# EAGLE design sensors (EAGLE 7.5.0)
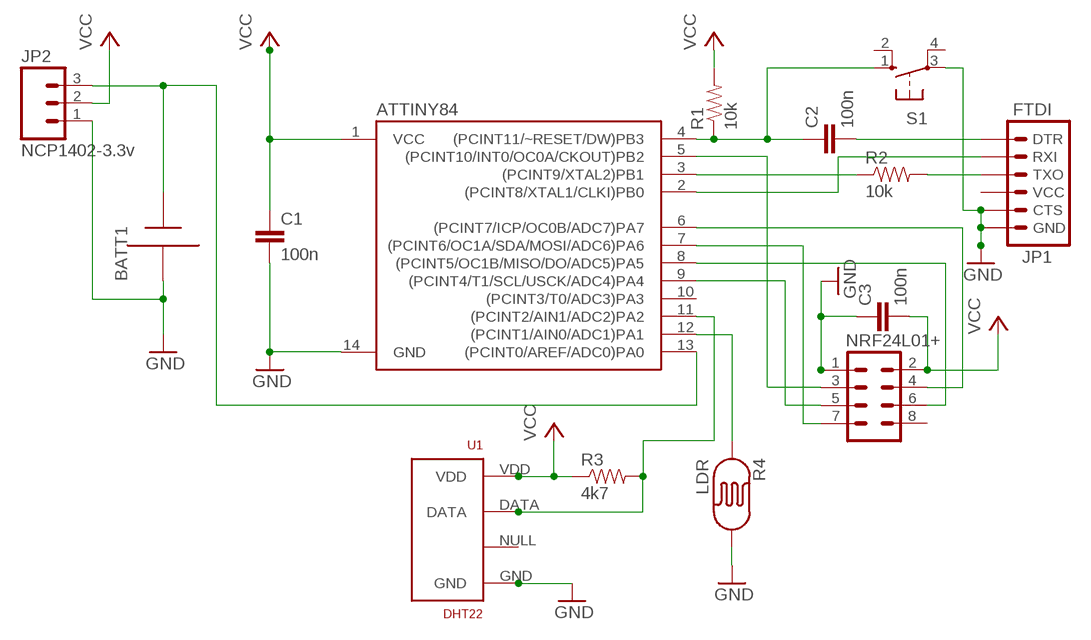
[diagram p0: schematic, sheet 1]

## Parts
ATTINY84  ATTINY84ATTINY84-20PU  [DIL14]
BATT1  AAA  [12BH412]
C1  100n  CAPPTH1  [CAP-PTH-5MM]
C2  100n  CAPPTH1  [CAP-PTH-5MM]
C3  100n  CAPPTH1  [CAP-PTH-5MM]
JP1  FTDI  ARDUINO_SERIAL_PROGRAMPTH  [1X06]
JP2  NCP1402-3.3v  M03PTH  [1X03]
NRF24L01+  M04X2  [2X4]
R1  10k  RESISTOREZ  [AXIAL-0.3EZ]
R2  10k  RESISTOREZ  [AXIAL-0.3EZ]
R3  4k7  RESISTOREZ  [AXIAL-0.3EZ]
R4  LDR  PHOTOCELLPTH  [PHOTOCELL]
S1  10-XX  [B3F-10XX]
U1  DHT22  RHT03_DHT-22_AM2302  [RHT03_DHT-22]

## Nets
GND: ATTINY84.14(GND) BATT1.- C1.2 C3.1 JP1.5(CTS) JP1.6(GND) JP2.1 NRF24L01+.1 R4.2 S1.3(P) U1.GND
N$1: ATTINY84.6((PCINT7/ICP/OC0B/ADC7)PA7) NRF24L01+.4
N$2: ATTINY84.3((PCINT9/XTAL2)PB1) R2.P$1
N$3: ATTINY84.4((PCINT11/~RESET/DW)PB3) C2.1 R1.P$1 S1.1(S)
N$4: C2.2 JP1.1(DTR)
N$5: JP1.3(TXO) R2.P$2
N$6: ATTINY84.2((PCINT8/XTAL1/CLKI)PB0) JP1.2(RXI)
N$7: ATTINY84.7((PCINT6/OC1A/SDA/MOSI/ADC6)PA6) NRF24L01+.7
N$8: ATTINY84.13((PCINT0/AREF/ADC0)PA0) BATT1.+ JP2.3
N$9: ATTINY84.9((PCINT4/T1/SCL/USCK/ADC4)PA4) NRF24L01+.5
N$10: ATTINY84.12((PCINT1/AIN0/ADC1)PA1) R4.1
N$11: ATTINY84.11((PCINT2/AIN1/ADC2)PA2) R3.P$2 U1.DATA
N$12: ATTINY84.8((PCINT5/OC1B/MISO/DO/ADC5)PA5) NRF24L01+.6
N$13: ATTINY84.5((PCINT10/INT0/OC0A/CKOUT)PB2) NRF24L01+.3
VCC: ATTINY84.1(VCC) C1.1 C3.2 JP2.2 NRF24L01+.2 R1.P$2 R3.P$1 U1.VDD
Unconnected: ATTINY84.10((PCINT3/T0/ADC3)PA3) JP1.4(VCC) NRF24L01+.8 S1.2(S1) S1.4(P1) U1.NULL

## Library data of the parts
ATTINY84 = SparkFun-DigitalIC:ATTINY84: Atmel 14-pin 2/4/8kB flash uC
BATT1 = adafruit:AAA: AAA PC pin holder Mouser part #12BH412 - but pretty much any 1x AAA battery holder should be the same http://www.ladyada.net/library/pcb/eaglelibrary.html
C1-C3 = SparkFun-Capacitors:CAP: Capacitor Standard 0603 ceramic capacitor, and 0.1" leaded capacitor.
JP1 = SparkFun-Connectors:ARDUINO_SERIAL_PROGRAM: FTDI connector footprints
JP2 = SparkFun-Connectors:M03: Header 3 Standard 3-pin 0.1" header. Use with straight break away headers (SKU : PRT-00116), right angle break away headers (PRT-00553), swiss pins (PRT-00743), machine pins (PRT-00117), and female headers (PRT-00115). Molex polarized connector foot print use with SKU : PRT-08232 with associated crimp pins and housings.
NRF24L01+ = SparkFun-Connectors:M04X2: .1" header, two rows of four.
R1-R3 = SparkFun-Resistors:RESISTOR: Resistor Basic schematic elements and footprints for 0603, 1206, and PTH resistors.
R4 = SparkFun-Sensors:PHOTOCELL: CdS photoresistor. This is a low cost way to detect light levels. Resistance decreases with more incoming light. SparkFun SKU: SEN-09088
S1 = switch-omron:10-XX: OMRON SWITCH; MPN: B3F-1000; OC_FARNELL: 176432; OC_NEWARK: 36M3542
U1 = RHT03_DHT-22_AM2302:RHT03_DHT-22_AM2302: RHT03 / DHT-22 / AM2302 Packages and symbol for the RHT03 / DHT-22 relative humidity and temperature sensor. Note: The AM2302 is a wired version of the DHT-22 which typically requires less clearance and is thus provided as a separate package.; PROD_ID: SEN-10167

## Net classes
0 default: clearance 0.205 mm

## Board
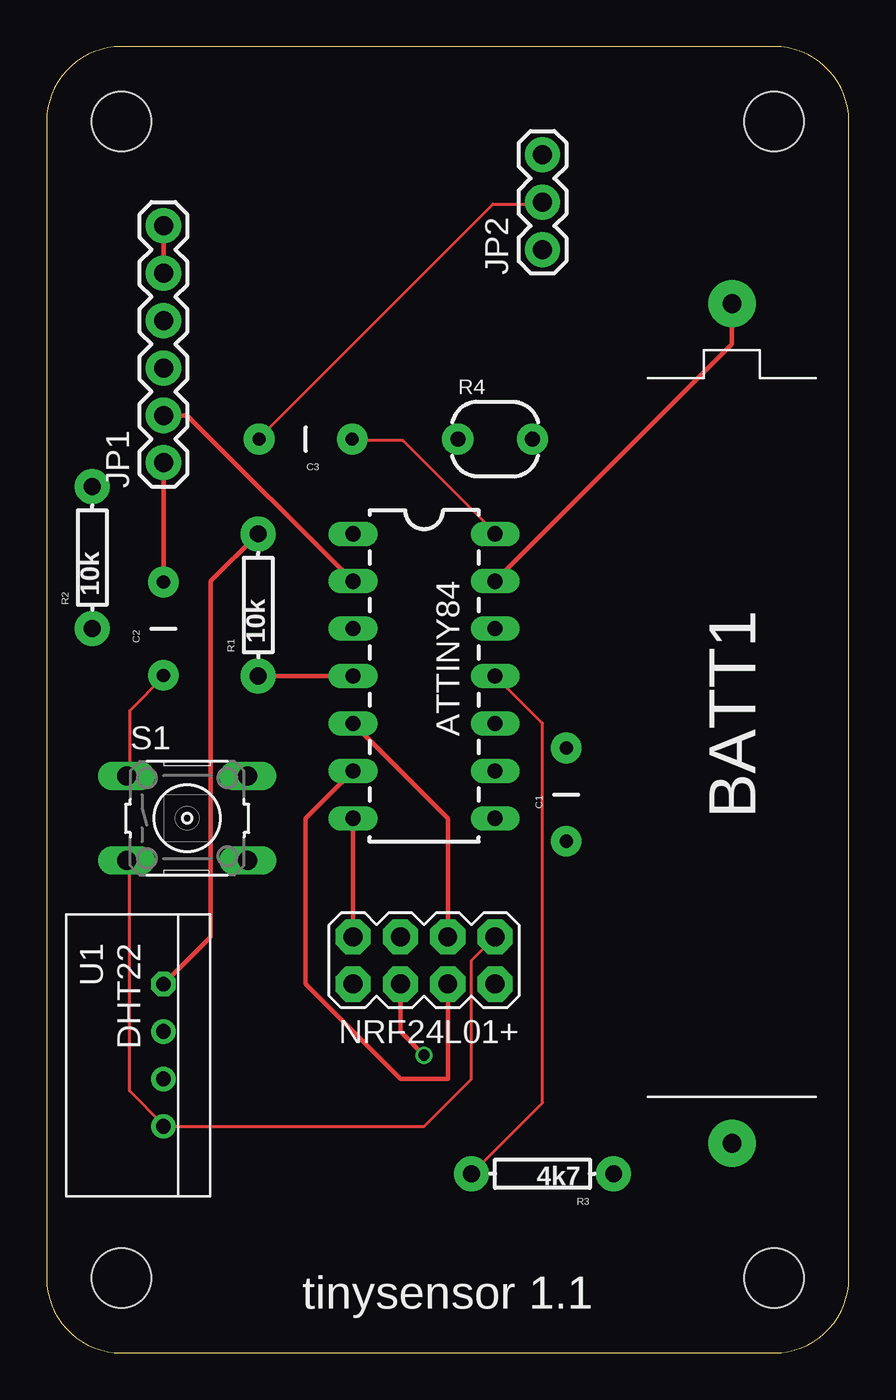
[diagram p1: board, top side]
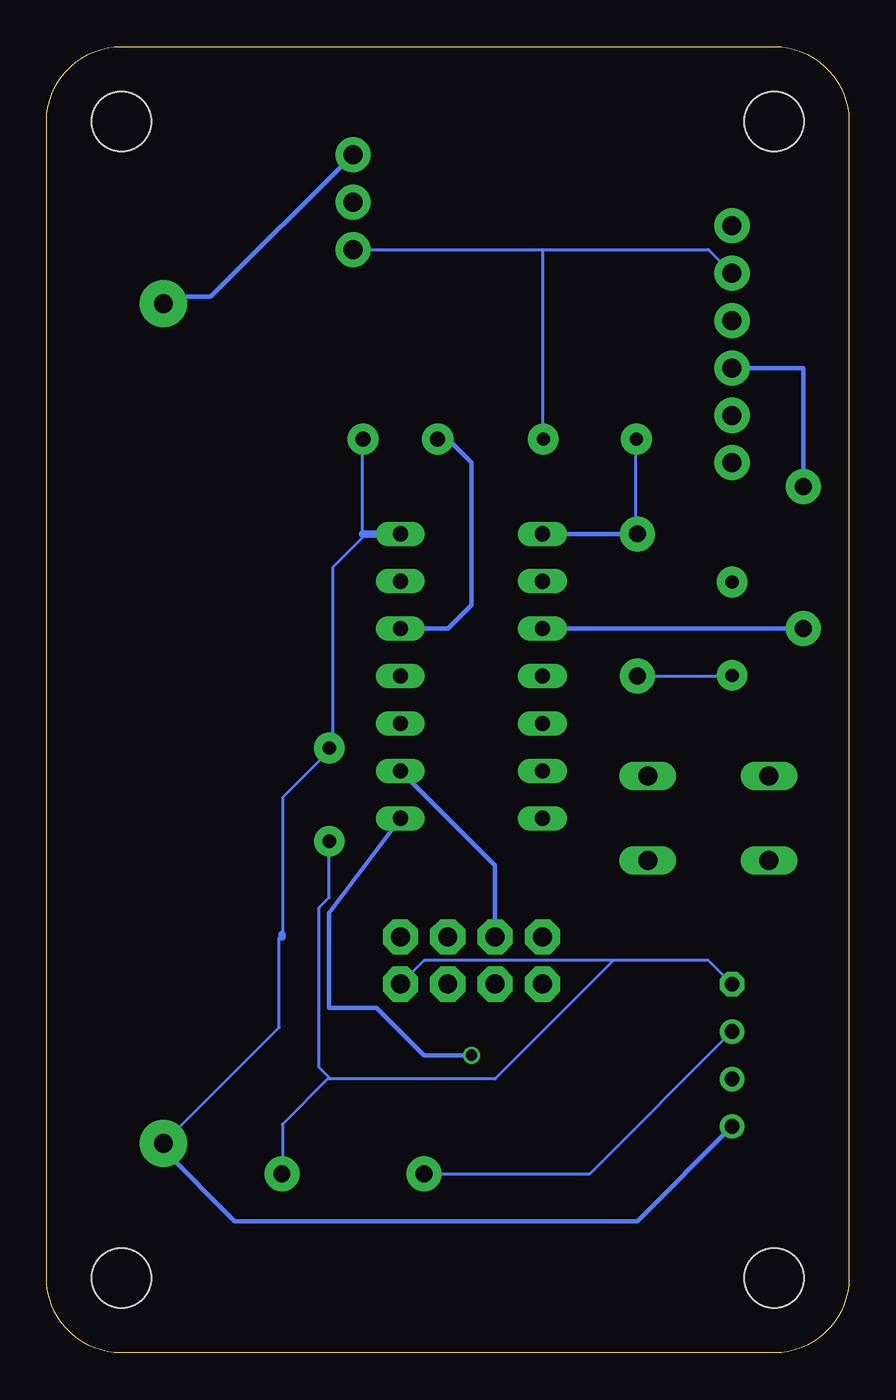
[diagram p2: board, bottom side, seen from below]

Size 43 x 70 mm. Coordinates in mm from the lower left corner, seen from the top.
Copper layers (1*16): Top 0.035mm / dielectric 1.5mm / Bottom 0.035mm
Design rules "SeeedStudio_2layer_DRU_no_angle_20140221": minimum track width 6mil, minimum drill 12mil, track to track 6mil, track to pad 6mil, pad to pad 6mil, via to via 6mil, smd to smd 0mil, copper to edge 10mil, drill to drill 10mil, minimum pad ring 10mil, minimum via ring 6mil, stop-mask expansion 2mil, vias tented up to drill 100mil, thermal gap 10mil

### Footprints (pad centres in the part's own frame; a part is rotated, then mirrored left to right if it is on the bottom)
DIL14 = drill 0.813 long: 1 -8.89,-3.81; 2 -6.35,-3.81; 3 -3.81,-3.81; 4 -1.27,-3.81; 5 1.27,-3.81; 6 3.81,-3.81; 7 6.35,-3.81; 8 6.35,3.81; 9 3.81,3.81; 10 1.27,3.81; 11 -1.27,3.81; 12 -3.81,3.81; 13 -6.35,3.81; 14 -8.89,3.81
12BH412 = drill 1 pad 2.54: + 22.5,0; - -22.5,0
CAP-PTH-5MM = drill 0.7 pad 1.651: 1 -2.5,0; 2 2.5,0
1X06 = drill 1.016 pad 1.88: 1 0,0; 2 2.54,0; 3 5.08,0; 4 7.62,0; 5 10.16,0; 6 12.7,0
1X03 = drill 1.016 pad 1.88: 1 0,0; 2 2.54,0; 3 5.08,0
2X4 = drill 1.016 pad 1.88 octagon: 1 -3.81,-1.27; 2 -3.81,1.27; 3 -1.27,-1.27; 4 -1.27,1.27; 5 1.27,-1.27; 6 1.27,1.27; 7 3.81,-1.27; 8 3.81,1.27
AXIAL-0.3EZ = drill 0.9 pad 1.88: P$1 -3.81,0; P$2 3.81,0
PHOTOCELL = drill 0.8 pad 1.676: 1 -2,0; 2 2,0
B3F-10XX = drill 1.016 long: 1 -3.251,2.261; 2 3.251,2.261; 3 -3.251,-2.261; 4 3.251,-2.261
RHT03_DHT-22 = drill 0.8: DATA -1.27,0; GND 3.81,0; NULL 1.27,0 | drill 0.8 octagon: VDD -3.81,0
DP7043_V1 = hole 3.2: -31,-17.5; 31,-17.5; 31,17.5; -31,17.5

### Placement (x,y rotation side)
ATTINY84  20.23,35 270 top
BATT1  36.74,33.73 90 top
C1  27.85,29.92 90 top
C2  6.26,38.81 90 top
C3  13.88,48.97 180 top
JP1  6.26,47.7 90 top
JP2  26.58,59.13 90 top
NRF24L01+  20.23,21.03 180 top
R1  11.34,40.08 90 top
R2  2.45,42.62 90 top
R3  26.58,9.6 180 top
R4  24.04,48.97 0 top
S1  7.53,28.65 0 top
U1  6.26,15.95 270 top
U$1  [DP7043_V1]  21.5,35 90 top

### Tracks (layer width: path | path; a pad name or v marks a point on that pad's centre or on a via)
GND
  Top 0.152: NRF24L01+.1 22.77,21.03 22.77,14.68 20.23,12.14 U1.GND 6.23,12.25 4.44,14.04 4.44,26.37 S1.3 | C3.1 16.41,48.88 19.09,48.88 23.92,44.06 ATTINY84.14
  Top 0.254: JP1.6 JP1.5
  Bottom 0.152: JP1.5 7.53,59.13 16.41,59.13 | JP2.1 16.41,59.13 | 16.41,59.13 16.41,49.06 C3.1 | R4.2 26.06,48.88 26.06,43.89 26.06,43.7 27.67,42.09 27.67,32.44 C1.2 27.85,32.26 30.35,29.76 30.35,22.61 30.39,22.44 30.53,22.44 | 30.39,22.3 30.53,22.26 30.53,17.43 36.61,11.36 BATT1.-
  Bottom 0.254: U1.GND 11.34,7.06 32.93,7.06 36.74,10.87 BATT1.- | ATTINY84.14 25.31,43.89
  Bottom 0.406: 30.39,22.3 30.39,22.44 | 26.06,43.89 ATTINY84.14
N$1
  Top 0.254: ATTINY84.6 13.88,28.65 13.88,19.76 18.96,14.68 21.5,14.68 NRF24L01+.4
N$2
  Bottom 0.254: R2.P$1 ATTINY84.3
N$3
  Top 0.152: S1.1 4.44,31.01 4.44,34.41 6.23,36.2 C2.1
  Top 0.254: R1.P$1 ATTINY84.4
  Bottom 0.152: R1.P$1 6.26,36.27 C2.1
N$4
  Top 0.254: JP1.1 C2.2
N$5
  Bottom 0.254: R2.P$2 2.45,52.78 JP1.3
N$6
  Top 0.254: ATTINY84.2 7.53,50.24 JP1.2
N$7
  Top 0.254: NRF24L01+.7 ATTINY84.7
N$8
  Top 0.254: ATTINY84.13 36.74,54.05 BATT1.+
  Bottom 0.254: JP2.3 34.2,56.59 36.74,56.59 BATT1.+
N$9
  Bottom 0.254: ATTINY84.9 18.96,26.11 NRF24L01+.5
N$10
  Bottom 0.152: 22.13,48.88 R4.1 21.95,49.06 21.42,49.06 21.5,48.97
  Bottom 0.254: ATTINY84.12 21.5,38.81 20.23,40.08 20.23,47.7 21.5,48.97
N$11
  Top 0.152: ATTINY84.11 26.58,33.73 26.58,13.41 R3.P$2
  Bottom 0.152: U1.DATA 13.88,9.6 R3.P$2
N$12  (via drill 0.61)
  Top 0.254: v20.23,15.95 18.96,17.22 NRF24L01+.6
  Bottom 0.254: ATTINY84.8 27.85,23.57 27.85,18.49 25.31,18.49 22.77,15.95 v20.23,15.95
N$13
  Top 0.254: ATTINY84.5 21.5,28.65 NRF24L01+.3
VCC
  Top 0.152: JP2.2 26.42,61.57 23.92,61.57 11.41,49.06 C3.2
  Top 0.254: U1.VDD 8.8,22.3 8.8,41.35 R1.P$2
  Bottom 0.152: NRF24L01+.2 22.77,21.03 12.61,21.03 | 12.61,21.03 7.53,21.03 U1.VDD | 12.61,21.03 18.96,14.68 27.85,14.68 27.85,14.75 | C3.2 11.41,48.88 11.41,44.06 R1.P$2 | 27.85,14.75 28.39,15.29 28.39,23.87 27.85,24.4 27.85,27.26 C1.1 | 27.85,14.75 30.35,12.25 30.35,9.75 R3.P$1
  Bottom 0.254: R1.P$2 ATTINY84.1

### Text on the board
tPlace: tinysensor 1.1